# EAGLE design untitled (EAGLE 7.6.0)
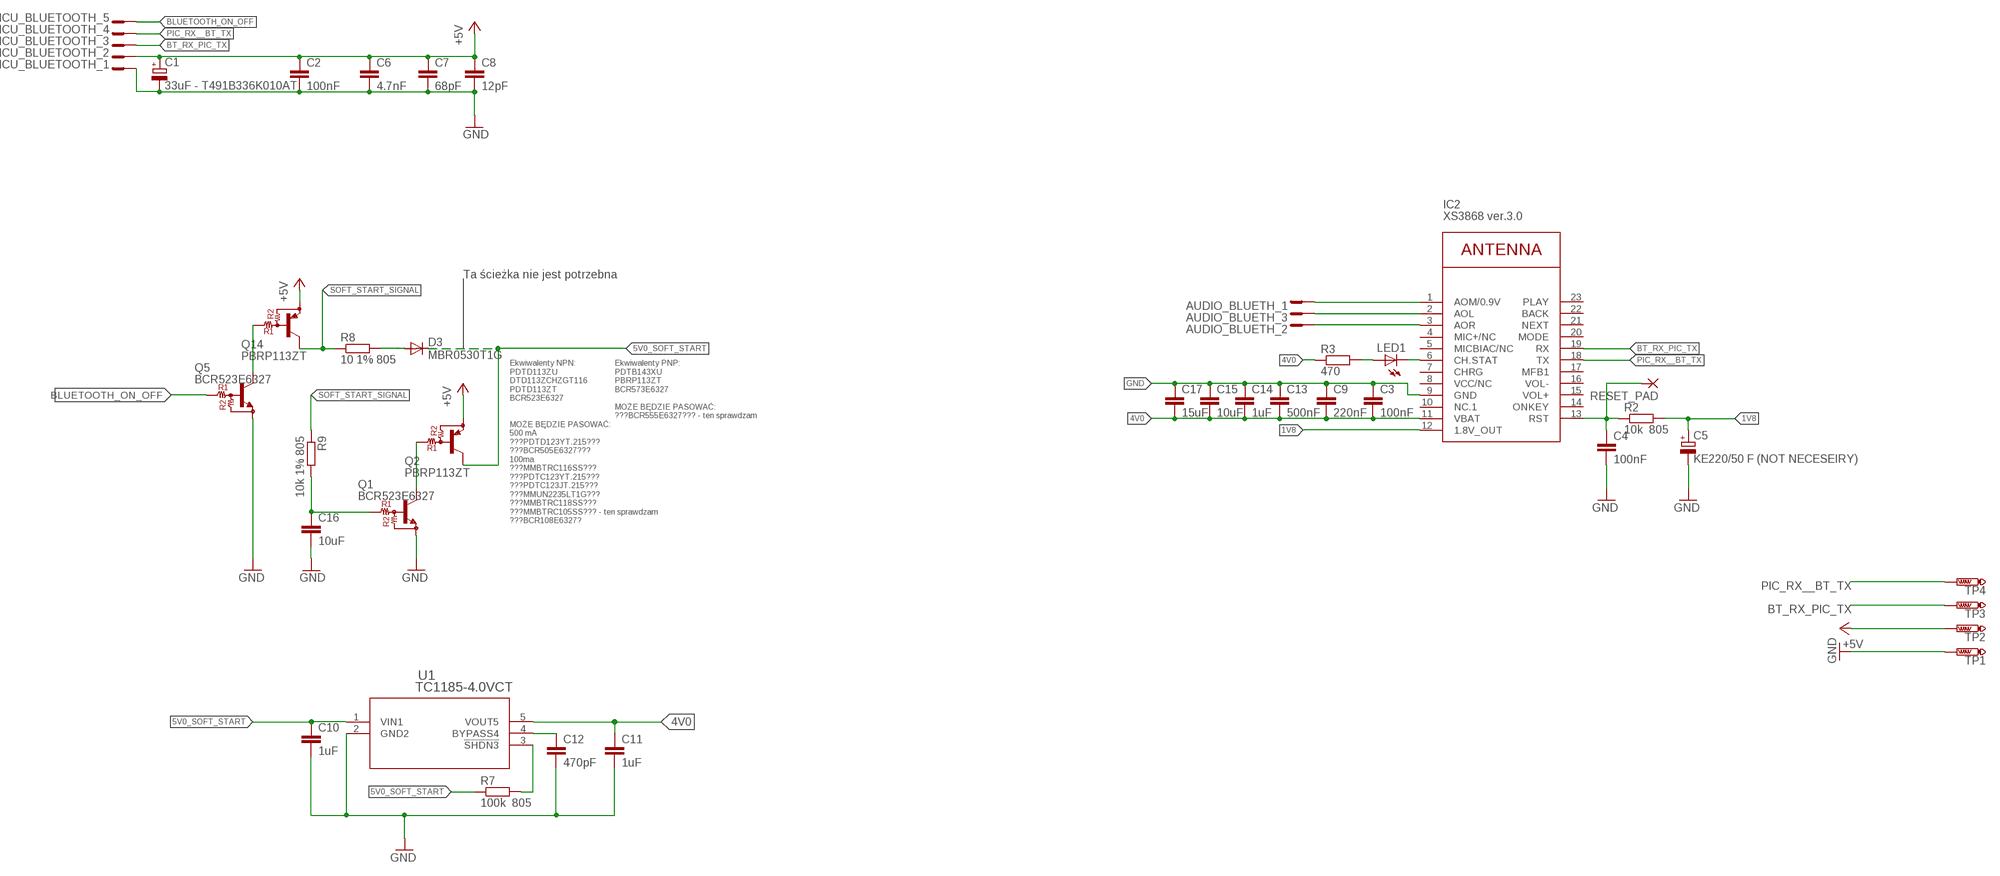
[diagram p0: schematic, sheet 1]

## Parts
AUDIO_BLUETH  JST_3_PIN_B3B-PH-KS  [B3B-PH-KS]
C1  33uF - T491B336K010AT  CPOL-EUSMCC  [SMC_C]
C2  100nF  C-EUC0805  [C0805]
C3  100nF  C-EUC0805  [C0805]
C4  100nF  C-EUC0805  [C0805]
C5  KE220/50 F (NOT NECESEIRY)  CPOL-EUG  [PANASONIC_G]
C6  4.7nF  C-EUC0805  [C0805]
C7  68pF  C-EUC0805  [C0805]
C8  12pF  C-EUC0805  [C0805]
C9  220nF  C-EUC0805  [C0805]
C10  1uF  C-EUC0805  [C0805]
C11  1uF  C-EUC0805  [C0805]
C12  470pF  C-EUC0805  [C0805]
C13  500nF  C-EUC0805  [C0805]
C14  1uF  C-EUC0805  [C0805]
C15  10uF  C-EUC0805  [C0805]
C16  10uF  C-EUC0805  [C0805]
C17  15uF  C-EUC0805  [C0805]
D3  MBR0530T1G  MBR0520LT  [SOD123]
IC2  XS3868 ver.3.0  WIRELESS-BLUETOOTH-XS3868  [WIRELESS-BLUETOOTH-XS3868]
LED1  LEDSML0805  [SML0805]
MCU_BLUETOOTH  JST_5_PIN_B5B-PH-KS  [B5B-PH-KS]
Q1  BCR523E6327  PDTD113ZU  [SOT-23]
Q2  PBRP113ZT  PDTB143XU  [SOT-23]
Q5  BCR523E6327  PDTD113ZU  [SOT-23]
Q14  PBRP113ZT  PDTB143XU  [SOT-23]
R2  10k 805  R-EU_M0805  [M0805]
R3  470  R-EU_M0805  [M0805]
R7  100k 805  R-EU_M0805  [M0805]
R8  10 1% 805  R-EU_M0805  [M0805]
R9  10k 1% 805  R-EU_M0805  [M0805]
RESET_PAD  SMD2  [SMD1,27-2,54]
TP1  PTR1B1,27  [B1,27]
TP2  PTR1B1,27  [B1,27]
TP3  PTR1B1,27  [B1,27]
TP4  PTR1B1,27  [B1,27]
U1  TC1185-4.0VCT  TC1185-X.XXCT713SOT-23-5_MC-M  [SOT-23-5_MC-M]

## Nets
1V8: C5.+ IC2.12(1.8V_OUT) R2.2
4V0: C3.2 C9.2 C11.1 C13.2 C14.2 C15.2 C17.2 IC2.11(VBAT) R3.1 U1.5(VOUT5)
5V0_SOFT_START: C10.1 D3.C Q2.3(C) R7.1 U1.1(VIN1)
+5V: C1.+ C2.1 C6.1 C7.1 C8.1 MCU_BLUETOOTH.P$2 Q2.2(E) Q14.2(E) TP2.TP
AUDIO_DIFF_COMMON: AUDIO_BLUETH.P$1 IC2.1(AOM/0.9V)
BLUETOOTH_ON_OFF: MCU_BLUETOOTH.P$5 Q5.1(B)
BT_LED: IC2.6(CH.STAT) LED1.C
BT_RX_PIC_TX: IC2.19(RX) MCU_BLUETOOTH.P$3 TP3.TP
BTOUT_LEFT: AUDIO_BLUETH.P$2 IC2.3(AOR)
BTOUT_RIGHT: AUDIO_BLUETH.P$3 IC2.2(AOL)
GND: C1.- C2.2 C3.1 C4.2 C5.- C6.2 C7.2 C8.2 C9.1 C10.2 C11.2 C12.2 C13.1 C14.1 C15.1 C16.2 C17.1 IC2.9(GND) MCU_BLUETOOTH.P$1 Q1.2(E) Q5.2(E) TP1.TP U1.2(GND2)
N$4: C12.1 U1.4(BYPASS4)
N$5: LED1.A R3.2
N$6: R7.2 U1.3(!SHDN3)
N$7: Q5.3(C) Q14.1(B)
N$8: C16.1 Q1.1(B) R9.2
N$9: Q1.3(C) Q2.1(B)
N$12: D3.A R8.2
PIC_RX__BT_TX: IC2.18(TX) MCU_BLUETOOTH.P$4 TP4.TP
RST: C4.1 IC2.13(RST) R2.1 RESET_PAD.1(P)
SOFT_START_SIGNAL: Q14.3(C) R8.1 R9.1
Unconnected: IC2.4(MIC+/NC) IC2.5(MICBIAC/NC) IC2.7(CHRG) IC2.8(VCC/NC) IC2.10(NC.1) IC2.14(ONKEY) IC2.15(VOL+) IC2.16(VOL-) IC2.17(MFB1) IC2.20(MODE) IC2.21(NEXT) IC2.22(BACK) IC2.23(PLAY)

## Notes on the sheet
- Ta ścieżka nie jest potrzebna
- Ekwiwalenty PNP:
  PDTB143XU
  PBRP113ZT
  BCR573E6327
  
  MOŻE BĘDZIE PASOWAĆ:
  ???BCR555E6327??? - ten sprawdzam
- Ekwiwalenty NPN:
  PDTD113ZU
  DTD113ZCHZGT116
  PDTD113ZT
  BCR523E6327
  
  
  MOŻE BĘDZIE PASOWAĆ:
  500 mA
  ???PDTD123YT.215???
  ???BCR505E6327???
  100ma
  ???MMBTRC116SS???
  ???PDTC123YT.215???
  ???PDTC123JT.215???
  ???MMUN2235LT1G???
  ???MMBTRC118SS???
  ???MMBTRC105SS??? - ten sprawdzam
  ???BCR108E6327?

## Library data of the parts
AUDIO_BLUETH = conn-JST:JST_3_PIN_
C1 = resistor:CPOL-EU: POLARIZED CAPACITOR, European symbol
C2-C4 C6-C15 C17 = resistor:C-EU: CAPACITOR, European symbol
C5 = rcl:CPOL-EU: POLARIZED CAPACITOR, European symbol
C16 = rcl:C-EU: CAPACITOR, European symbol
D3 = diode:MBR0520LT: SCHOTTKY BARRIER RECTIFIER Source: http://onsemi.com .. MBR0520LT1-D.pdf
IC2 = diy-modules:WIRELESS-BLUETOOTH-XS3868: Bluetooth Stereo Audio Module based on OVC3860 chip More details available here: http://artofcircuits.com/product/bluetooth-2-0-edr-stereo-audio-ovc3860-module-model-xs-3868 Click here to find device on ebay.com <http://www.ebay.com/sch/xs3868+bluetooth+audio+module>
LED1 = led:LED: LED OSRAM: - CHIPLED LG R971, LG N971, LY N971, LG Q971, LY Q971, LO R971, LY R971 LH N974, LH R974 LS Q976, LO Q976, LY Q976 LO Q996 - Hyper CHIPLED LW Q18S LB Q993, LB Q99A, LB R99A - SideLED LS A670, LO A670, LY A670, LG A670, LP A670 LB A673, LV A673, LT A673, LW A673 LH A674 LY A675 LS A676, LA A676, LO A676, LY A676, LW A676 LS A679, LY A679, LG A679 - Hyper Micro SIDELED® LS Y876, LA Y876, LO Y876, LY Y876 LT Y87S - SmartLED LW L88C, LW L88S LB L89C, LB L89S, LG L890 LS L89K, LO L89K, LY L89K LS L896, LA L896, LO L896, LY L896 - TOPLED LS T670, LO T670, LY T670, LG T670, LP T670 LSG T670, LSP T670, LSY T670, LOP T670, LYG T670 LG T671, LOG T671, LSG T671 LB T673, LV T673, LT T673, LW T673 LH T674 LS T676, LA T676, LO T676, LY T676, LB T676, LH T676, LSB T676, LW T676 LB T67C, LV T67C, LT T67C, LS T67K, LO T67K, LY T67K, LW E67C LS E67B, LA E67B, LO E67B, LY E67B, LB E67C, LV E67C, LT E67C LW T67C LS T679, LY T679, LG T679 LS T770, LO T770, LY T770, LG T770, LP T770 LB T773, LV T773, LT T773, LW T773 LH T774 LS E675, LA E675, LY E675, LS T675 LS T776, LA T776, LO T776, LY T776, LB T776 LHGB T686 LT T68C, LB T68C - Hyper Mini TOPLED® LB M676 - Mini TOPLED Santana® LG M470 LS M47K, LO M47K, LY M47K Source: http://www.osram.convergy.de LUXEON: - LUMILED® LXK2-PW12-R00, LXK2-PW12-S00, LXK2-PW14-U00, LXK2-PW14-V00 LXK2-PM12-R00, LXK2-PM12-S00, LXK2-PM14-U00 LXK2-PE12-Q00, LXK2-PE12-R00, LXK2-PE12-S00, LXK2-PE14-T00, LXK2-PE14-U00 LXK2-PB12-K00, LXK2-PB12-L00, LXK2-PB12-M00, LXK2-PB14-N00, LXK2-PB14-P00, LXK2-PB14-Q00 LXK2-PR12-L00, LXK2-PR12-M00, LXK2-PR14-Q00, LXK2-PR14-R00 LXK2-PD12-Q00, LXK2-PD12-R00, LXK2-PD12-S00 LXK2-PH12-R00, LXK2-PH12-S00 LXK2-PL12-P00, LXK2-PL12-Q00, LXK2-PL12-R00 Source: www.luxeon.com KINGBRIGHT: KA-3528ASYC Source: www.kingbright.com
MCU_BLUETOOTH = conn-JST:JST_5_PIN_
Q1 Q5 = pre-bias-transistor:PDTD: Pre biase NPN transistor NPN Resistor-Equipped Transistor (RET) family in a very small SOT323 (SC-70) Surface-Mounted Device (SMD) plastic package. VCC = 50V Ic (max) = 500 mA; R1: 1 kOhm; R2: 10 kOhm
Q2 Q14 = pre-bias-transistor:PDTB: PNP Resistor-Equipped Transistor (RET) family in a very small SOT323 (SC-70) Surface-Mounted Device (SMD) plastic package. VCC = -50 IC (max) = -500mA; R1: 4.7 kOhm; R2: 10 kOhm
R2 R3 R7-R9 = rcl:R-EU_: RESISTOR, European symbol
RESET_PAD = wirepad:SMD2: SMD PAD
TP1-TP4 = testpad:PTR1: TEST PIN
U1 = TC1185:TC1185-X.XXCT713; MANUFACTURER_PART_NUMBER: TC1185X.XXCT713; VENDOR: Microchip

## Board
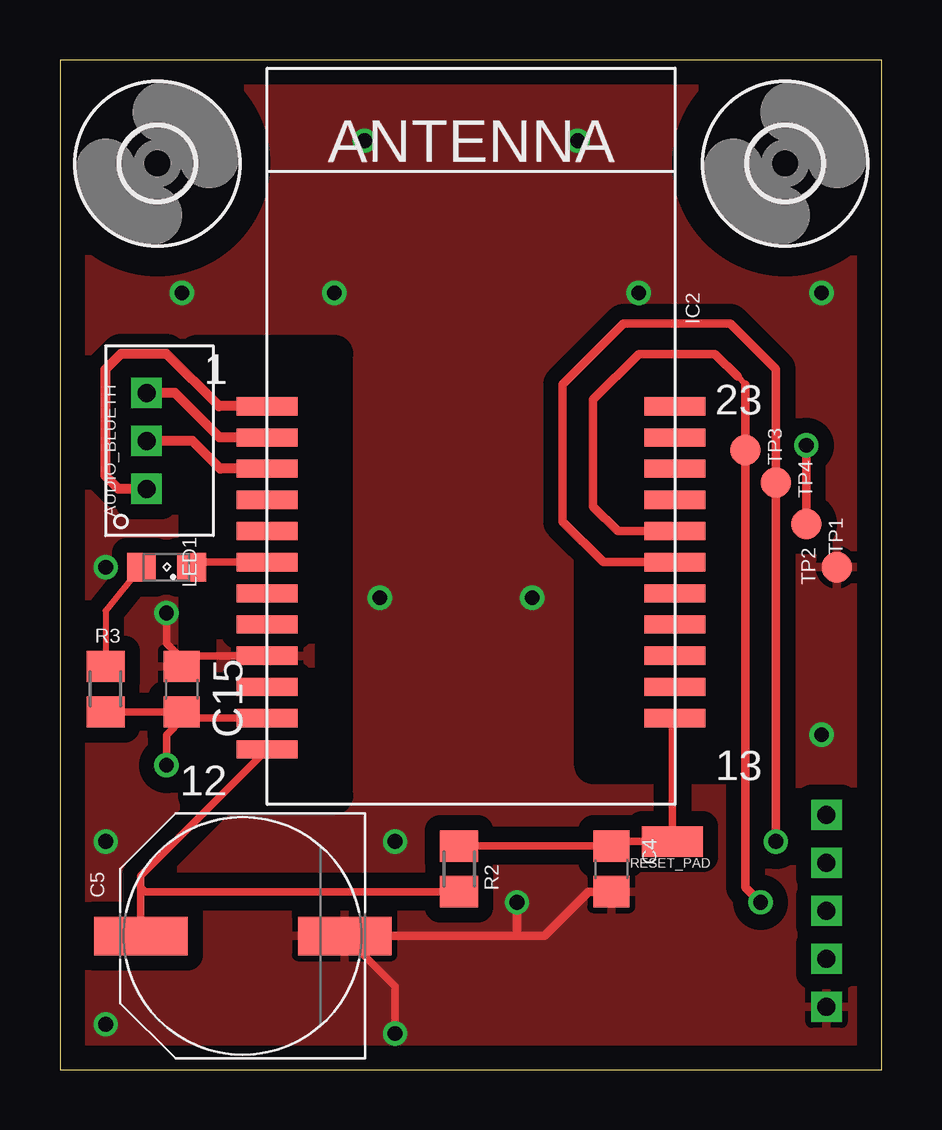
[diagram p1: board, top side]
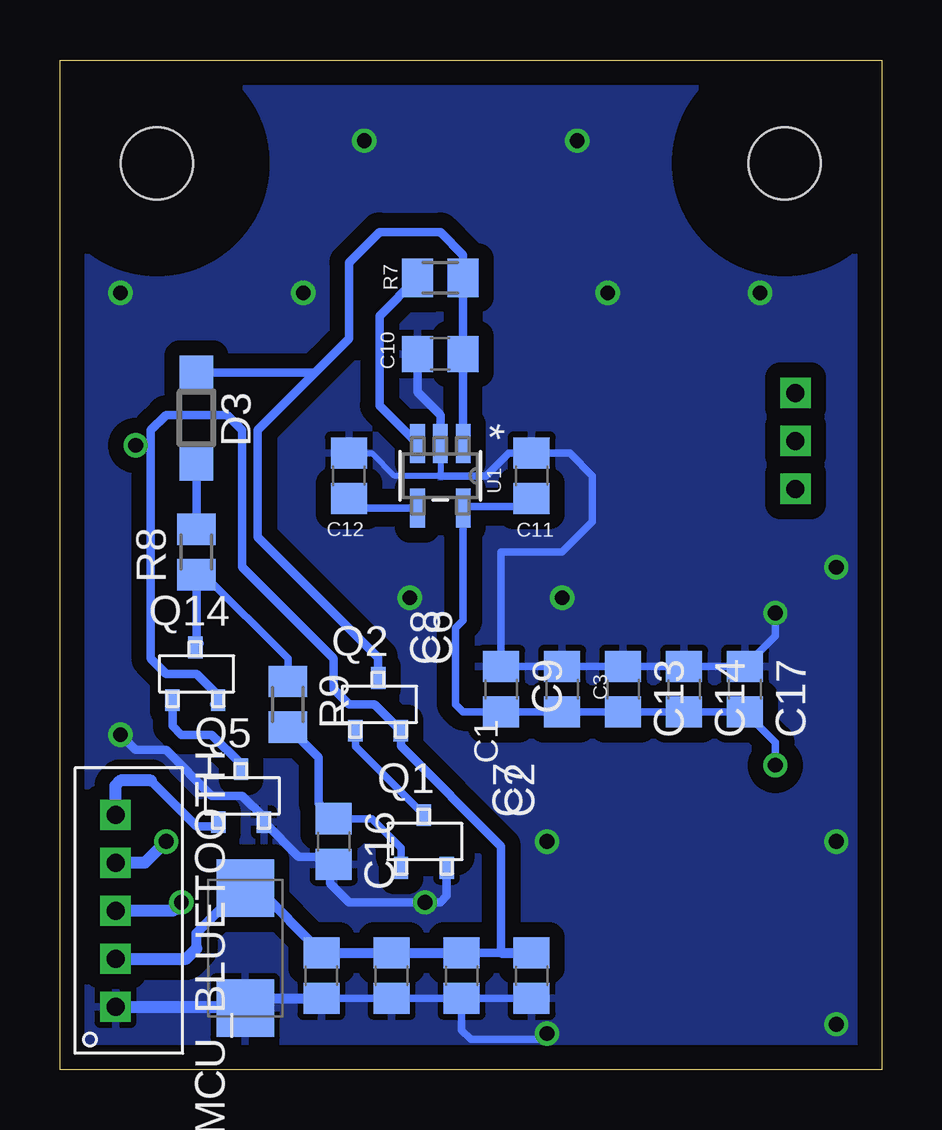
[diagram p2: board, bottom side, seen from below]

Size 34.27 x 42.1 mm. Coordinates in mm from the lower left corner, seen from the top.
Outline: 0,0 34.27,0 34.27,42.1 0,42.1 0,0
Copper layers (1*16): Top 0.035mm / dielectric 1.5mm / Bottom 0.035mm
Design rules "default": minimum track width 10mil, minimum drill 24mil, track to track 8mil, track to pad 8mil, pad to pad 8mil, via to via 8mil, smd to smd 8mil, copper to edge 40mil, drill to drill 8mil, minimum pad ring 10mil, minimum via ring 8mil, stop-mask expansion 4mil, vias tented up to drill 0mil, thermal gap 10mil
tRestrict: 8 lines
bRestrict: area 17.8,8.9 to 20.3,8.9

### Footprints (pad centres in the part's own frame; a part is rotated, then mirrored left to right if it is on the bottom)
B3B-PH-KS = drill 0.75 pad 1.2 square: P$1 -2,1.7; P$2 -4,1.7; P$3 -6,1.7
SMC_C = smd 2.4 x 2.4: + -2.5,0; - 2.5,0
C0805 = smd 1.3 x 1.5: 1 -0.95,0; 2 0.95,0
PANASONIC_G = smd 3.9 x 1.6: + 4.25,0; - -4.25,0
SOD123 = smd 1.4 x 1.4: A 1.9,0; C -1.9,0
WIRELESS-BLUETOOTH-XS3868 = smd 2.54 x 0.762: 1 -8.5,0.995; 2 -8.5,-0.305; 3 -8.5,-1.605; 4 -8.5,-2.905; 5 -8.5,-4.205; 6 -8.5,-5.505; 7 -8.5,-6.805; 8 -8.5,-8.105; 9 -8.5,-9.405; 10 -8.5,-10.705; 11 -8.5,-12.005; 12 -8.5,-13.305; 13 8.5,-12.005; 14 8.5,-10.705; 15 8.5,-9.405; 16 8.5,-8.105; 17 8.5,-6.805; 18 8.5,-5.505; 19 8.5,-4.205; 20 8.5,-2.905; 21 8.5,-1.605; 22 8.5,-0.305; 23 8.5,0.995
SML0805 = smd 1.2 x 1.2: A 1.05,0; C -1.05,0
B5B-PH-KS = drill 0.75 pad 1.2 square: P$1 -2,1.7; P$2 -4,1.7; P$3 -6,1.7; P$4 -8,1.7; P$5 -10,1.7
SOT-23 = smd 0.6 x 0.9: 1 -1,-1.1; 2 0.9,-1.1; 3 -0.05,1.1
M0805 = smd 1.3 x 1.6: 1 -0.95,0; 2 0.95,0
SMD1,27-2,54 = smd 1.27 x 2.54: 1 0,0
B1,27 = smd 1.27 x 1.27: TP 0,0
SOT-23-5_MC-M = smd 1.626 x 0.61: 1 -1.346,0.95; 2 -1.346,0; 3 -1.346,-0.95; 4 1.346,-0.95; 5 1.346,0.95
3,0 = hole 3: 0,0

### Placement (x,y rotation side)
AUDIO_BLUETH  1.9,22.23 270 top
C1  26.54,5.08 270 bottom
C2  23.37,3.94 270 bottom
C3  13.33,15.88 270 bottom
C4  22.99,8.38 270 top
C5  7.62,5.59 180 top
C6  20.45,3.94 270 bottom
C7  17.53,3.94 270 bottom
C8  14.6,3.94 270 bottom
C9  15.87,15.88 270 bottom
C10  18.41,29.84 180 bottom
C11  14.6,24.77 90 bottom
C12  22.23,24.77 90 bottom
C13  10.79,15.88 270 bottom
C14  8.26,15.88 270 bottom
C15  5.08,15.88 270 top
C16  22.86,9.52 270 bottom
C17  5.71,15.88 270 bottom
D3  28.57,27.18 270 bottom
IC2  17.14,26.67 0 top
LED1  4.44,20.96 180 top
MCU_BLUETOOTH  33.65,0.63 270 bottom
Q1  19.05,9.52 0 bottom
Q2  20.95,15.24 0 bottom
Q5  26.67,11.43 0 bottom
Q14  28.57,16.51 0 bottom
R2  16.64,8.38 270 top
R3  1.9,15.88 90 top
R7  18.41,33.02 180 bottom
R8  28.57,21.59 90 bottom
R9  24.77,15.24 270 bottom
RESET_PAD  25.53,9.52 270 top
TP1  32.38,20.96 0 top
TP2  31.11,22.77 0 top
TP3  28.57,25.85 0 top
TP4  29.84,24.48 0 top
U1  18.41,24.77 270 bottom
U$2  [3,0]  4.06,37.78 0 top
U$3  [3,0]  30.23,37.78 0 top

### Tracks (layer width: path | path; a pad name or v marks a point on that pad's centre or on a via)
1V8
  Top 0.305: IC2.12 3.37,8.09 3.37,7.62 | 3.37,7.62 C5.+ | R2.2 3.56,7.43 3.37,7.62
4V0  (via drill 0.61)
  Top 0.305: C15.2 R3.1 | IC2.11 5.34,14.66 C15.2 | C15.2 5.08,14.61 4.44,13.97 v4.44,12.7
  Bottom 0.305: C17.2 5.4,14.93 | C17.2 C14.2 C13.2 C3.2 C9.2 17.46,14.93 17.78,15.24 17.78,18.41 17.46,18.73 U1.5 17.39,23.5 14.6,23.5 C11.1 | v4.44,12.7 4.44,13.66 C17.2
5V0_SOFT_START
  Bottom 0.356: 28.07,28.57 D3.C 23.63,29.08 | Q2.3 21.01,17.2 26.03,22.23 26.03,26.67 23.63,29.08 | U1.1 C10.1 R7.1 17.46,33.98 18.41,34.93 20.95,34.93 22.23,33.66 22.23,30.48 23.49,29.21 23.63,29.08
+5V  (via drill 0.61)
  Top 0.356: TP2.TP v31.11,26.04
  Bottom 0.356: 15.02,5.3 C8.1 | 27.84,15.24 Q14.2 27.67,15.61 28.57,16.51 29.84,16.51 30.48,17.14 30.48,26.04 | v31.11,26.04 30.48,26.04 | C7.1 15.87,4.89 15.87,9.32 20.05,13.51 Q2.2 21.16,15.24 22.23,15.24 22.86,15.88 22.86,17.14 26.67,20.96 26.67,26.67 27.3,27.3 29.84,27.3 30.48,26.67 30.48,26.04
  Bottom 0.406: C7.1 C6.1 C2.1 | C2.1 23.85,4.89 | C2.1 26.06,7.58 C1.+ 26.54,7.09 27.2,7.09 28.57,5.72 28.57,5.06 | 15.87,4.89 C8.1
  Bottom 0.508: MCU_BLUETOOTH.P$2 29,4.63 28.57,5.06
AUDIO_DIFF_COMMON
  Top 0.406: IC2.1 6.62,27.66 4.44,29.84 2.54,29.84 1.9,29.21 1.9,24.77 2.44,24.23 AUDIO_BLUETH.P$1
BLUETOOTH_ON_OFF
  Bottom 0.356: Q5.1 27.84,10.16 28.57,10.16 30.48,12.07
  Bottom 0.508: 30.48,12.07 31.75,12.07 31.95,11.86 MCU_BLUETOOTH.P$5
BT_LED
  Top 0.305: LED1.C 5.71,21.16 IC2.6
BT_RX_PIC_TX  (via drill 0.61)
  Top 0.254: TP3.TP 28.57,28.57 28.26,28.89
  Top 0.356: IC2.19 23.26,22.46 22.23,23.5 22.23,27.94 24.13,29.84 27.3,29.84 28.26,28.89 | 28.57,28.57 28.57,7.62 v29.21,6.99
  Bottom 0.508: v29.21,6.99 29.56,6.64 MCU_BLUETOOTH.P$3
BTOUT_LEFT
  Top 0.406: IC2.3 6.68,25.07 5.52,26.23 AUDIO_BLUETH.P$2
BTOUT_RIGHT
  Top 0.406: IC2.2 6.65,26.37 4.79,28.23 AUDIO_BLUETH.P$3
GND  (via drill 0.61)
  Top 0.305: IC2.9 5.52,17.27 C15.1 5.08,17.14 4.44,17.78 v4.44,19.05 | 12.06,5.39 C5.- 13.97,3.49 v13.97,1.52
  Top 0.356: C4.2 22.04,7.43 20.19,5.59 19.05,5.59 | 19.05,5.59 C5.- | v19.05,6.99 19.05,5.59
  Bottom 0.254: U1.2 18.41,24.77 20.32,24.77 21.27,25.71 C12.2
  Bottom 0.305: C2.2 C6.2 C7.2 | C17.1 C14.1 C13.1 C3.1 C9.1 15.87,21.59 13.33,21.59 12.06,22.86 12.06,24.77 13.01,25.71 C11.2 15.56,25.71 16.51,24.77 18.41,24.77 | C17.1 5.39,17.14 | v4.44,19.05 4.44,18.1 C17.1 | C7.2 C8.2 | C7.2 17.53,1.65 17.14,1.27 14.22,1.27 v13.97,1.52
  Bottom 0.356: 23.01,8.43 C16.2 | 23.01,8.43 23.01,7.77 22.23,6.99 v19.05,6.99 18.41,6.99 18.15,7.25 Q1.2 | U1.2 18.41,27.3 19.37,28.26 C10.2 | 23.01,8.43 23.48,8.89 24.33,8.89 Q5.2 25.77,10.53 26.67,11.43 27.94,11.43 29.84,13.34 31.11,13.34 v31.75,13.97
  Bottom 0.406: C2.2 25.53,2.99 C1.- 26.79,2.63
  Bottom 0.508: MCU_BLUETOOTH.P$1 26.79,2.63
  other vias: 5.08,32.38 31.75,32.38 1.9,1.91 1.9,9.52 13.97,9.52 11.43,32.38 24.13,32.38 13.33,19.69 19.69,19.69 12.7,38.73 21.59,38.73 1.9,20.96
  pour Bottom (isolate 0.635): -1.91,24.13 -1.91,43.18 36.2,43.18 36.2,-1.27 -0.64,-1.27 -1.91,-1.27
  pour Top (isolate 0.635): -1.91,22.86 -1.91,43.18 36.2,43.18 36.2,-1.27 -1.91,-1.27
N$4
  Bottom 0.305: U1.4 21.83,23.42 C12.1
N$5
  Top 0.254: LED1.A 1.9,19.14 R3.2
N$6
  Bottom 0.356: R7.2 20.95,31.43 20.95,27.7 U1.3
N$7
  Bottom 0.356: Q5.3 26.72,12.75 27.94,13.97 29.21,13.97 29.57,14.34 Q14.1
N$8
  Bottom 0.305: Q1.1 20.05,9.25 21.27,10.48 C16.1
  Bottom 0.356: C16.1 23.49,11.11 23.49,13.02 R9.2
N$9
  Bottom 0.305: Q1.3 21.95,13.48 Q2.1
N$12
  Bottom 0.356: D3.A R8.2
PIC_RX__BT_TX  (via drill 0.61)
  Top 0.254: TP4.TP 29.84,29.21
  Top 0.356: IC2.18 22.65,21.16 20.95,22.86 20.95,28.57 23.49,31.12 27.94,31.12 29.84,29.21 v29.84,9.52
  Bottom 0.508: v29.84,9.52 30.73,8.64 MCU_BLUETOOTH.P$4
RST
  Top 0.305: IC2.13 25.53,14.66 RESET_PAD.1 23.18,9.52 C4.1 R2.1
SOFT_START_SIGNAL
  Bottom 0.305: R9.1 24.77,17.14 28.26,20.64 R8.1
  Bottom 0.356: R8.1 28.57,17.66 Q14.3 28.45,17.78 | 25.09,16.51 R9.1